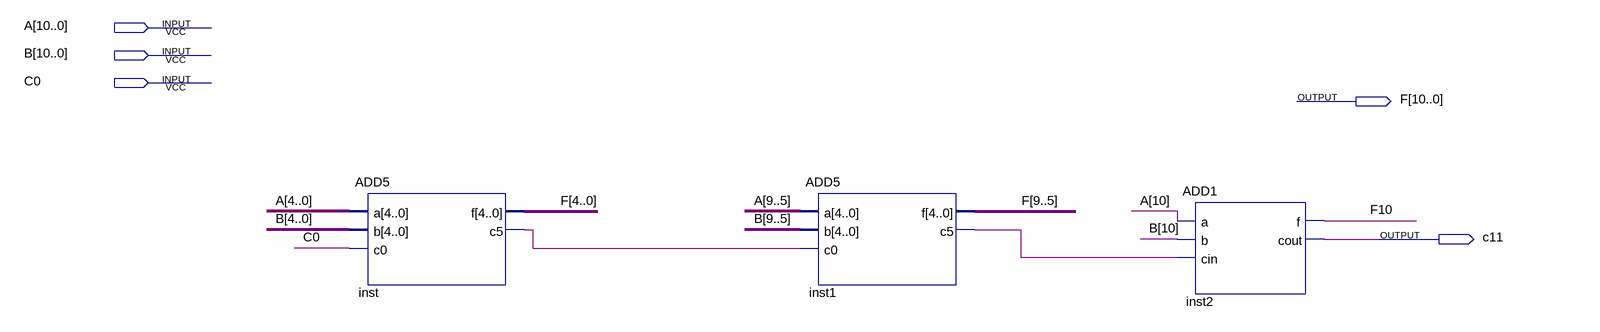
[diagram p0: schematic sheet]
// Quartus schematic ADD11.bdf as structural Verilog: 3 symbols, 5 pins
module ADD11 (
  input  [10:0] A,
  input  [10:0] B,
  input  C0,
  output [10:0] F,
  output c11
);

  wire inst1_c5, inst_c5;

  ADD5 inst (.a(A[4:0]), .b(B[4:0]), .c0(C0), .f(F[4:0]), .c5(inst_c5));
  ADD5 inst1 (.a(A[9:5]), .b(B[9:5]), .c0(inst_c5), .f(F[9:5]), .c5(inst1_c5));
  ADD1 inst2 (.a(A[10]), .b(B[10]), .cin(inst1_c5), .f(F[10]), .cout(c11));
endmodule
